# EAGLE design FA58GHZ (EAGLE 7.4.0)
Assembly variants: Standard
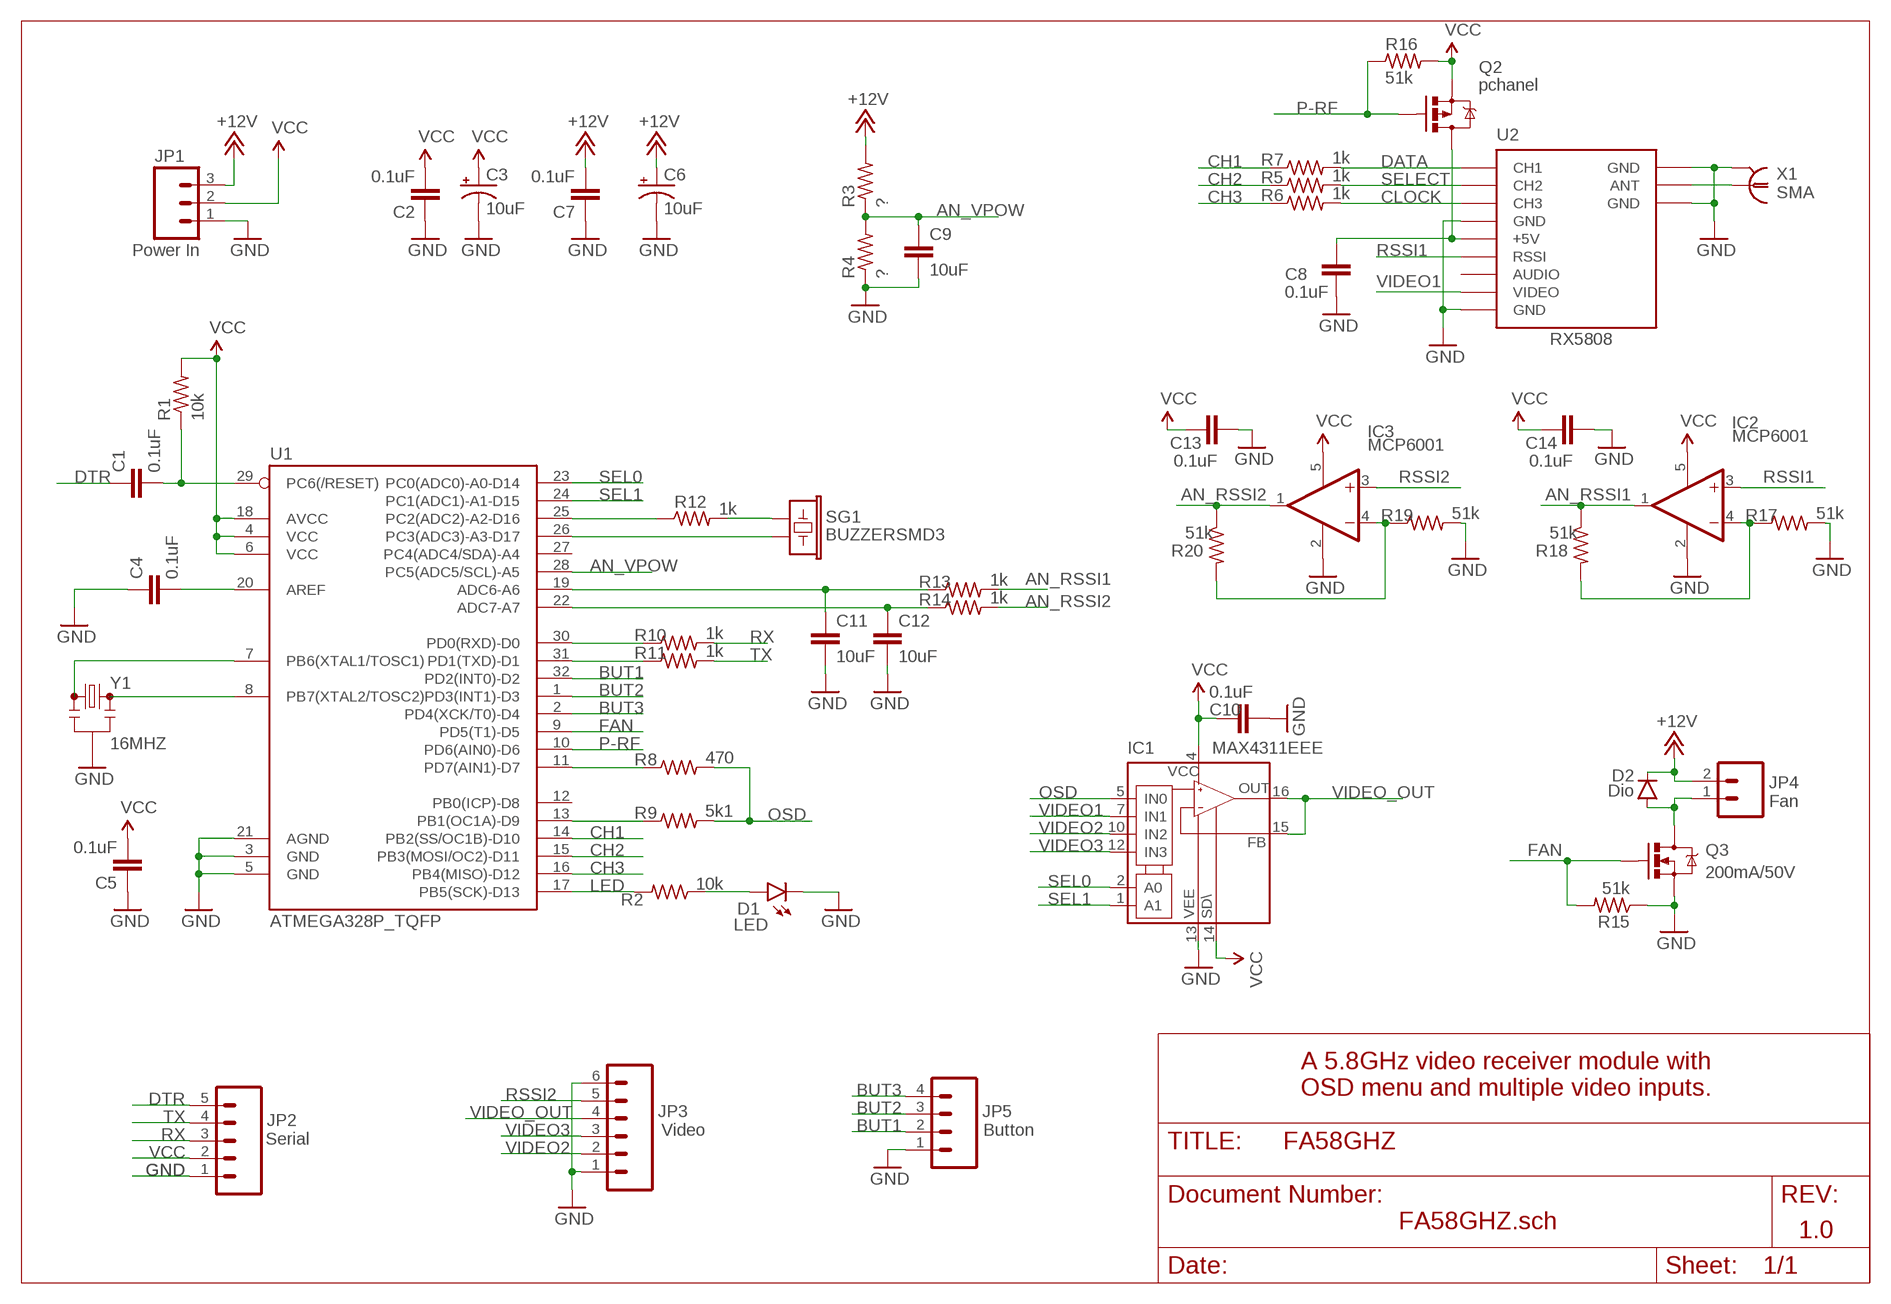
[diagram p0: schematic, sheet 1]

## Parts
C1  0.1uF  C-EUC0603  [C0603]
C2  0.1uF  C-EUC0603  [C0603]
C3  10uF  10UF-16V-10%(TANT)  [EIA3216]
C4  0.1uF  C-EUC0603  [C0603]
C5  0.1uF  C-EUC0603  [C0603]
C6  10uF  10UF-16V-10%(TANT)  [EIA3216]
C7  0.1uF  C-EUC0603  [C0603]
C8  0.1uF  C-EUC0603  [C0603]
C9  10uF  CAP0603-CAP  [0603-CAP]
C10  0.1uF  C-EUC0603  [C0603]
C11  10uF  CAP0603-CAP  [0603-CAP]
C12  10uF  CAP0603-CAP  [0603-CAP]
C13  0.1uF  C-EUC0603  [C0603]
C14  0.1uF  C-EUC0603  [C0603]
D1  LED  LED0603  [LED-0603]
D2  Dio  DIODEBAS16  [SOD-323]
IC1  MAX4311EEE  [QSOP16]
IC2  MCP6001  [SC70-5]
IC3  MCP6001  [SC70-5]
JP1  Power In  M03  [1X03-1.27MM-OFFSET]
JP2  Serial  M05  [1X05-1.27MM-OFFSET]
JP3  Video  M06  [1X06-1.27MM-OFFSET]
JP4  Fan  M02  [1X02-1.27MM-OFFSET]
JP5  Button  M04  [1X04-1.27MM-OFFSET]
Q2  pchanel  MOSFET-PCHANNEL  [SOT23-3]
Q3  200mA/50V  MOSFET-NCHANNELBSS138  [SOT23-3]
R1  10k  R-US_R0603  [R0603]
R2  10k  R-US_R0603  [R0603]
R3  ?  R-US_R0603  [R0603]
R4  ?  R-US_R0603  [R0603]
R5  1k  R-US_R0603  [R0603]
R6  1k  R-US_R0603  [R0603]
R7  1k  R-US_R0603  [R0603]
R8  470  R-US_R0603  [R0603]
R9  5k1  R-US_R0603  [R0603]
R10  1k  R-US_R0603  [R0603]
R11  1k  R-US_R0603  [R0603]
R12  1k  R-US_R0603  [R0603]
R13  1k  R-US_R0603  [R0603]
R14  1k  R-US_R0603  [R0603]
R15  51k  R-US_R0603  [R0603]
R16  51k  R-US_R0603  [R0603]
R17  51k  R-US_R0603  [R0603]
R18  51k  R-US_R0603  [R0603]
R19  51k  R-US_R0603  [R0603]
R20  51k  R-US_R0603  [R0603]
SG1  BUZZERSMD3  [BUZZER-12X12X3MM]
U1  ATMEGA328P_TQFP  [TQFP32-08]
U2  RX5808  [RX5808]
X1  SMA  SMA-SMDPCB  [SMA-PCB]
Y1  16MHZ  OSCILLATOR16MHZ  [RESONATOR-SMD]

## Nets
+12V: C6.A(+) C7.2 D2.C JP1.3 JP4.2 R3.2
AN_RSSI1: IC2.1(OUT) R13.2 R18.1
AN_RSSI2: IC3.1(OUT) R14.2 R20.1
AN_VPOW: C9.1 R3.1 R4.2 U1.28(PC5(ADC5/SCL)-A5)
BUT1: JP5.2 U1.32(PD2(INT0)-D2)
BUT2: JP5.3 U1.1(PD3(INT1)-D3)
BUT3: JP5.4 U1.2(PD4(XCK/T0)-D4)
CH1: R7.1 U1.14(PB2(SS/OC1B)-D10)
CH2: R5.1 U1.15(PB3(MOSI/OC2)-D11)
CH3: R6.1 U1.16(PB4(MISO)-D12)
CLOCK: R6.2 U2.P$7(CH3)
DATA: R7.2 U2.P$9(CH1)
DTR: C1.1 JP2.5
FAN: Q3.1(G) R15.2 U1.9(PD5(T1)-D5)
GND: C2.1 C3.C(-) C4.1 C5.1 C6.C(-) C7.1 C8.2 C9.2 C10.1 C11.2 C12.2 C13.2 C14.2 D1.C IC1.13(V-) IC2.2(V-) IC3.2(V-) JP1.1 JP2.1 JP3.1 JP3.6 JP5.1 Q3.2(S) R4.1 R15.1 R17.2 R19.2 U1.3(GND) U1.5(GND) U1.21(AGND) U2.P$1(GND) U2.P$6(GND) U2.P$10(GND) U2.P$12(GND) X1.P$1@1 X1.P$1@2 Y1.2
LED: R2.2 U1.17(PB5(SCK)-D13)
N$1: U1.8(PB7(XTAL2/TOSC2)) Y1.3
N$2: U1.7(PB6(XTAL1/TOSC1)) Y1.1
N$3: C1.2 R1.1 U1.29(PC6(/RESET))
N$4: C4.2 U1.20(AREF)
N$5: D1.A R2.1
N$6: R8.1 U1.11(PD7(AIN1)-D7)
N$7: R9.1 U1.13(PB1(OC1A)-D9)
N$8: R10.1 U1.30(PD0(RXD)-D0)
N$9: R11.1 U1.31(PD1(TXD)-D1)
N$10: R12.1 U1.25(PC2(ADC2)-A2-D16)
N$11: SG1.2 U1.26(PC3(ADC3)-A3-D17)
N$12: R12.2 SG1.1
N$13: D2.A JP4.1 Q3.3(D)
N$14: IC2.4(-IN) R17.1 R18.2
N$15: IC3.4(-IN) R19.1 R20.2
N$16: U2.P$11(ANT) X1.P$2
N$17: C12.1 R14.1 U1.22(ADC7-A7)
N$18: C11.1 R13.1 U1.19(ADC6-A6)
N$20: C8.1 Q2.3(D) U2.P$5(+5V)
OSD: IC1.5(IN0) R8.2 R9.2
P-RF: Q2.1(G) R16.1 U1.10(PD6(AIN0)-D6)
RSSI1: IC2.3(+IN) U2.P$4(RSSI)
RSSI2: IC3.3(+IN) JP3.5
RX: JP2.3 R10.2
SEL0: IC1.2(A0) U1.23(PC0(ADC0)-A0-D14)
SEL1: IC1.1(A1) U1.24(PC1(ADC1)-A1-D15)
SELECT: R5.2 U2.P$8(CH2)
TX: JP2.4 R11.2
VCC: C2.2 C3.A(+) C5.2 C10.2 C13.1 C14.1 IC1.4(V+) IC1.14(!SHDN) IC2.5(V+) IC3.5(V+) JP1.2 JP2.2 Q2.2(S) R1.2 R16.2 U1.4(VCC) U1.6(VCC) U1.18(AVCC)
VIDEO1: IC1.7(IN1) U2.P$2(VIDEO)
VIDEO2: IC1.10(IN2) JP3.2
VIDEO3: IC1.12(IN3) JP3.3
VIDEO_OUT: IC1.15(FB) IC1.16(OUT) JP3.4
Unconnected: U1.12(PB0(ICP)-D8) U1.27(PC4(ADC4/SDA)-A4) U2.P$3(AUDIO)

## Notes on the sheet
- A 5.8GHz video receiver module with
  OSD menu and multiple video inputs.
- FA58GHZ.sch
- 1.0

## Library data of the parts
C1 C2 C4 C5 C7 C8 C10 C13 C14 = resistor:C-EU: CAPACITOR, European symbol
C3 C6 = SparkFun-Capacitors:10UF-16V-10%(TANT): CAP-00811 1206/EIA-3216 Tantalum capacitor; PROD_ID: CAP-00811
C9 C11 C12 = SparkFun-Passives:CAP: Capacitor Standard 0603 ceramic capacitor, and 0.1" leaded capacitor.
D1 = SparkFun-LED:LED: LEDs Standard schematic elements and footprints for 5mm, 3mm, 1206, and 0603 sized LEDs. 5mm - Spark Fun Electronics SKU : COM-00529 (and others)
D2 = SparkFun-DiscreteSemi:DIODE: Diode These are standard reverse protection diodes and small signal diodes. SMA package can handle up to about 1A. SOD-323 can handle about 200mA. What the SOD-323 package when ordering, there are some mfgs out there that are 5-pin packages.; PROD_ID: DIO-09646; VALUE: 250mA/100V
IC1 = FreakyAttic-EagleLibrary:MAX4311: Video Multiplexer-Amplifier High-Speed, Low-Power, Single-Supply, Multichannel; MF: MAXIM; MPN: MAX4311EEE+; OC_FARNELL: unknown; OC_NEWARK: 65J5493
IC2 IC3 = FreakyAttic-EagleLibrary:MCP6001: MCP6001 • Available in SC-70-5 and SOT-23-5 packages • Gain Bandwidth Product: 1 MHz (typical) • Rail-to-Rail Input/Output • Supply Voltage: 1.8V to 6.0V • Supply Current: IQ = 100 μA (typical) • Phase Margin: 90° (typical) • Temperature Range: - Industrial: -40°C to +85°C - Extended: -40°C to +125°C • Available in Single, Dual and Quad Packages
JP1 = FreakyAttic-EagleLibrary:M03: Header 3 Standard 3-pin 0.1" header. Use with straight break away headers (SKU : PRT-00116), right angle break away headers (PRT-00553), swiss pins (PRT-00743), machine pins (PRT-00117), and female headers (PRT-00115). Molex polarized connector foot print use with SKU : PRT-08232 with associated crimp pins and housings.
JP2 = FreakyAttic-EagleLibrary:M05: Header 5 Standard 5-pin 0.1" header. Use with straight break away headers (SKU : PRT-00116), right angle break away headers (PRT-00553), swiss pins (PRT-00743), machine pins (PRT-00117), and female headers (PRT-00115). Molex polarized connector foot print use with SKU : PRT-08230 with associated crimp pins and housings.
JP3 = FreakyAttic-EagleLibrary:M06: Header 6 Standard 6-pin 0.1" header. Use with straight break away headers (SKU : PRT-00116), right angle break away headers (PRT-00553), swiss pins (PRT-00743), machine pins (PRT-00117), and female headers (PRT-00115). Molex polarized connector foot print use with SKU : PRT-08094 with associated crimp pins and housings. NOTES ON THE VARIANTS LOCK and LOCK_LONGPADS... This footprint was designed to help hold the alignment of a through-hole component (i.e. 6-pin header) while soldering it into place. You may notice that each hole has been shifted either up or down by 0.005 of an inch from it's more standard position (which is a perfectly straight line). This slight alteration caused the pins (the squares in the middle) to touch the edges of the holes. Because they are alternating, it causes a "brace" to hold the component in place. 0.005 has proven to be the perfect amount of "off-center" position when using our standard breakaway headers. Although looks a little odd when you look at the bare footprint, once you have a header in there, the alteration is very hard to notice. Also,if you push a header all the way into place, it is covered up entirely on the bottom side. This idea of altering the position of holes to aid alignment will be further integrated into the Sparkfun Library for other footprints. It can help hold any component with 3 or more connection pins.
JP4 = FreakyAttic-EagleLibrary:M02: Standard 2-pin 0.1" header. Use with - straight break away headers ( PRT-00116) - right angle break away headers (PRT-00553) - swiss pins (PRT-00743) - machine pins (PRT-00117) - female headers (PRT-00115) Molex polarized connector foot print use with: PRT-08233 with associated crimp pins and housings. 2.54_SCREWTERM for use with PRT-10571. 3.5mm Screw Terminal footprints for PRT-08084 5mm Screw Terminal footprints for use with PRT-08432
JP5 = FreakyAttic-EagleLibrary:M04: Header 4 Standard 4-pin 0.1" header. Use with straight break away headers (SKU : PRT-00116), right angle break away headers (PRT-00553), swiss pins (PRT-00743), machine pins (PRT-00117), and female headers (PRT-00115). Molex polarized connector foot print use with SKU : PRT-08231 with associated crimp pins and housings. 1MM SMD Version SKU: PRT-10208
Q2 = SparkFun-DiscreteSemi:MOSFET-PCHANNEL: Generic PMOSFET IRLML2244 - TRANS-11153 (SOT-23 -20V -4.3A) (1.Gate 2.Source 3.Drain) FQP27P06 - COM-10349 <http://www.sparkfun.com/products/10349> (TO-220 -60V -27A) (1.Gate 2.Source 3.Drain); PROD_ID: TRANS-08285
Q3 = SparkFun-DiscreteSemi:MOSFET-NCHANNEL: Common NMOSFET Parts MFG P/N Store ID Prod ID FDD8780 TRANS-09984 SI7820DN TRANS-11055 FDS6630A IC-08089 2N7002PW TRANS-11151 FQP30N06L COM-10213 TRANS-10060 BSS123LT1G TRANS-08345 BSS138 TRANS-00830 BS170 2N7000; PROD_ID: TRANS-00830
R1-R20 = resistor:R-US_: RESISTOR, American symbol
SG1 = FreakyAttic-EagleLibrary:BUZZER: Buzzer 12mm Spark Fun Electronics SKU : Comp-Buzzer
U1 = SparkFun-DigitalIC:ATMEGA328P_TQFP; PROD_ID: IC-09069
U2 = FreakyAttic-EagleLibrary:RX5808: Boscam FPV 5.8G Wireless Audio Video Receiving Module RX5808
X1 = FreakyAttic-EagleLibrary:SMA-SMD: SMA for border PCB
Y1 = FreakyAttic-EagleLibrary:OSCILLATOR: Resonator Small SMD resonator. Used, eg, on the Arduino Pro/ Pro Mini boards. 8MHz- XTAL-08895 16MHz- XTAL-08900; PROD_ID: XTAL-08900

## Net classes
0 default: clearance 0.205 mm

## Board
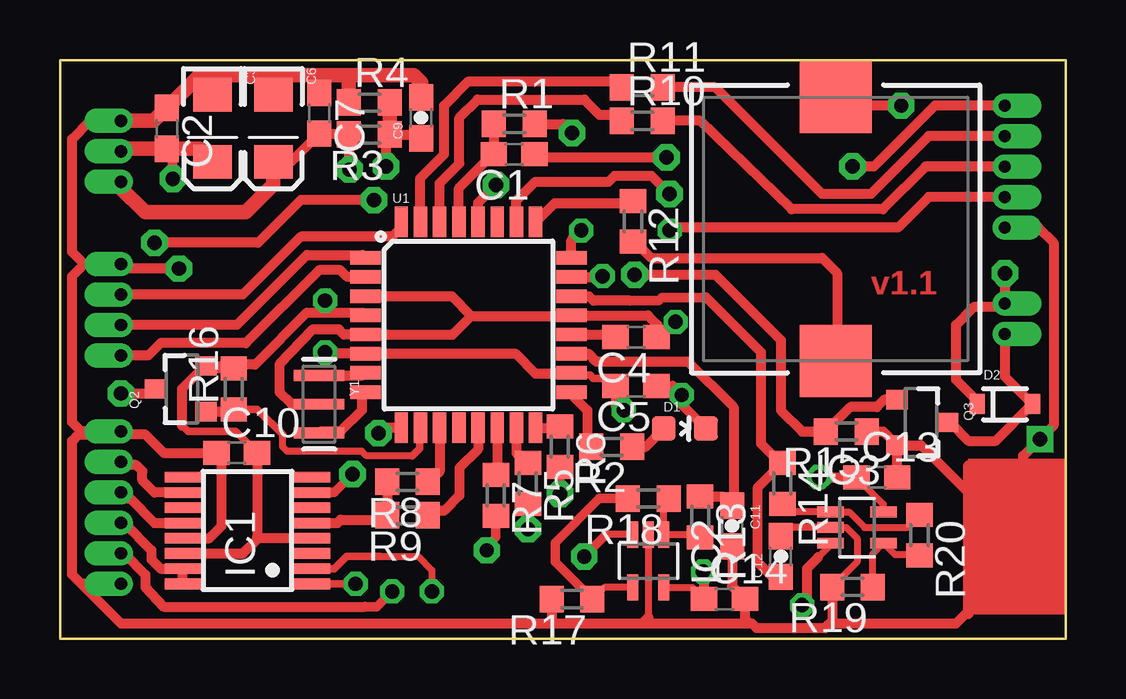
[diagram p1: board, top side]
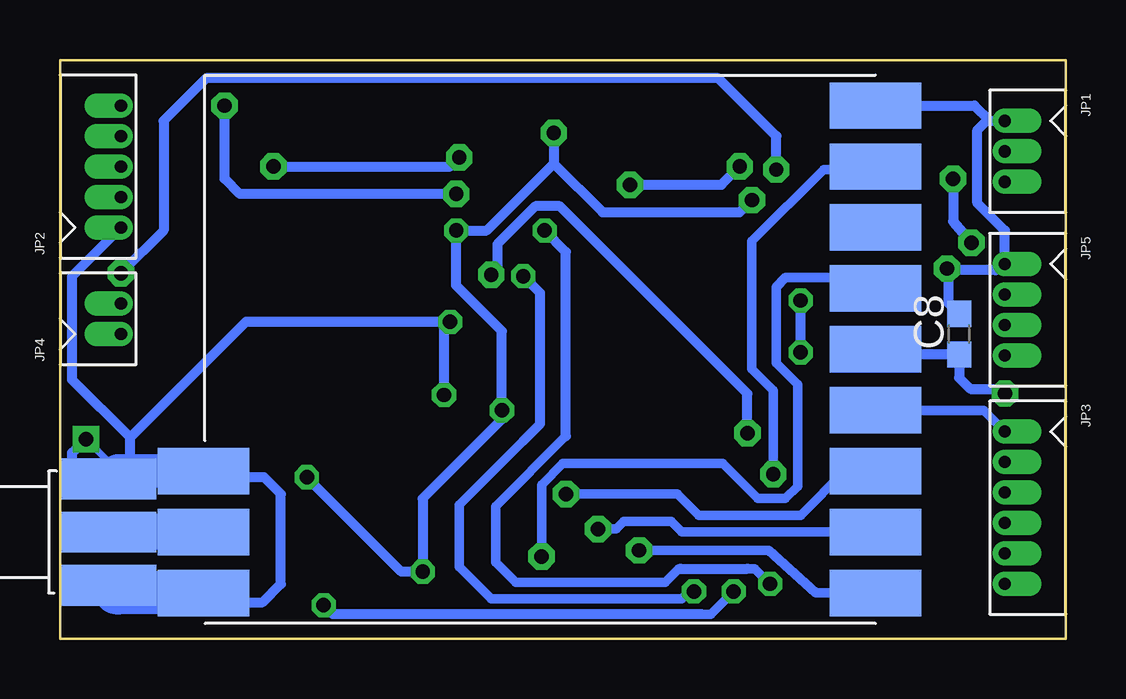
[diagram p2: board, bottom side, seen from below]

Size 41.91 x 24.13 mm. Coordinates in mm from the lower left corner, seen from the top.
Outline: 0,0 41.91,0 41.91,24.13 0,24.13 0,0
Copper layers (1*16): Top 0.035mm / dielectric 1.5mm / Bottom 0.035mm
Design rules "default": minimum track width 10mil, minimum drill 24mil, track to track 8mil, track to pad 8mil, pad to pad 8mil, via to via 8mil, smd to smd 8mil, copper to edge 40mil, drill to drill 8mil, minimum pad ring 10mil, minimum via ring 8mil, stop-mask expansion 4mil, vias tented up to drill 0mil, thermal gap 10mil

### Footprints (pad centres in the part's own frame; a part is rotated, then mirrored left to right if it is on the bottom)
C0603 = smd 1.1 x 1: 1 -0.85,0; 2 0.85,0
EIA3216 = smd 1.4 x 1.6: A 1.4,0; C -1.4,0
0603-CAP = smd 1.1 x 1: 1 -0.85,0; 2 0.85,0
LED-0603 = smd 1 x 1: A 0,-0.877; C 0,0.877
SOD-323 = smd 0.63 x 0.83: A 1.15,0; C -1.15,0
QSOP16 = smd 0.44 x 1.5: 1 -2.223,-2.69; 2 -1.587,-2.69; 3 -0.953,-2.69; 4 -0.318,-2.69; 5 0.318,-2.69; 6 0.953,-2.69; 7 1.587,-2.69; 8 2.223,-2.69; 9 2.223,2.69; 10 1.587,2.69; 11 0.953,2.69; 12 0.318,2.69; 13 -0.318,2.69; 14 -0.953,2.69; 15 -1.587,2.69; 16 -2.223,2.69
SC70-5 = smd 0.45 x 1.1: 1 -0.65,-1.1; 2 0,-1.1; 3 0.65,-1.1; 4 0.65,1.1; 5 -0.65,1.1
1X03-1.27MM-OFFSET = drill 0.508 pad 1 offset: 1 0,0; 2 1.27,0; 3 2.54,0
1X05-1.27MM-OFFSET = drill 0.508 pad 1 offset: 1 0,0; 2 1.27,0; 3 2.54,0; 4 3.81,0; 5 5.08,0
1X06-1.27MM-OFFSET = drill 0.508 pad 1 offset: 1 0,0; 2 1.27,0; 3 2.54,0; 4 3.81,0; 5 5.08,0; 6 6.35,0
1X02-1.27MM-OFFSET = drill 0.508 pad 1 offset: 1 0,0; 2 1.27,0
1X04-1.27MM-OFFSET = drill 0.508 pad 1 offset: 1 0,0; 2 1.27,0; 3 2.54,0; 4 3.81,0
SOT23-3 = smd 0.8 x 0.9: 1 -0.95,-1; 2 0.95,-1; 3 0,1.1
R0603 = smd 1 x 1.1: 1 -0.85,0; 2 0.85,0
BUZZER-12X12X3MM = smd 3 x 3: 1 -5.5,0; 2 5.5,0
TQFP32-08 = smd 1.27 x 0.559: 1 -4.293,2.8; 2 -4.293,2; 3 -4.293,1.2; 4 -4.293,0.4; 5 -4.293,-0.4; 6 -4.293,-1.2; 7 -4.293,-2; 8 -4.293,-2.8; 17 4.293,-2.8; 18 4.293,-2; 19 4.293,-1.2; 20 4.293,-0.4; 21 4.293,0.4; 22 4.293,1.2; 23 4.293,2; 24 4.293,2.8 | smd 0.559 x 1.27: 9 -2.8,-4.293; 10 -2,-4.293; 11 -1.2,-4.293; 12 -0.4,-4.293; 13 0.4,-4.293; 14 1.2,-4.293; 15 2,-4.293; 16 2.8,-4.293; 25 2.8,4.293; 26 2,4.293; 27 1.2,4.293; 28 0.4,4.293; 29 -0.4,4.293; 30 -1.2,4.293; 31 -2,4.293; 32 -2.8,4.293
RX5808 = smd 3.81 x 1.93: P$1 0,-20.32; P$2 0,-17.78; P$3 0,-15.24; P$4 0,-12.7; P$5 0,-10.16; P$6 0,-7.62; P$7 0,-5.08; P$8 0,-2.54; P$9 0,0; P$10 28,0; P$11 28,-2.54; P$12 28,-5.08
SMA-PCB = smd 4 x 1.7: P$1@1 2,-0.318; P$1@2 2,-4.763; P$2 2,-2.54
RESONATOR-SMD = smd 0.45 x 2.1: 1 -1.2,0; 2 0,0; 3 1.2,0

### Placement (x,y rotation side)
C1  18.92,20.19 180 top
C2  4.45,21.27 270 top
C3  6.35,21.27 270 top
C4  24,12.57 180 top
C5  24,10.54 180 top
C6  8.89,21.27 270 top
C7  10.79,21.91 270 top
C8  4.45,12.7 90 bottom
C9  15.05,21.72 90 top
C10  7.37,7.75 0 top
C11  28,4.7 270 top
C12  30.04,3.43 90 top
C13  34.04,6.73 0 top
C14  27.69,1.65 0 top
D1  26.04,8.76 270 top
D2  39.37,9.78 0 top
IC1  7.81,4.51 90 top
IC2  24.51,3.24 180 top
IC3  33.21,4.64 270 top
JP1  2.54,21.59 270 bottom
JP2  39.37,17.14 90 bottom
JP3  2.54,8.64 270 bottom
JP4  39.37,12.7 90 bottom
JP5  2.54,15.62 270 bottom
Q2  5.08,10.41 90 top
Q3  35.88,9.02 270 top
R1  18.92,21.46 0 top
R2  22.99,8 180 top
R3  12.89,21.02 180 top
R4  12.89,22.35 0 top
R5  19.49,6.48 270 top
R6  20.83,8 270 top
R7  18.16,5.97 270 top
R8  14.48,6.54 180 top
R9  14.48,5.14 180 top
R10  24.26,21.59 0 top
R11  24.26,22.99 0 top
R12  23.88,17.4 270 top
R13  26.67,5.08 270 top
R14  30.1,6.48 270 top
R15  32.77,8.64 180 top
R16  7.24,10.41 90 top
R17  21.34,1.65 180 top
R18  24.51,5.84 180 top
R19  33.02,2.16 180 top
R20  35.81,4.32 270 top
SG1  32.32,17.08 90 top
U1  17.02,13.08 0 top
U2  7.94,1.91 180 bottom
X1  41.91,6.99 0 bottom
Y1  10.79,9.78 270 top

### Tracks (layer width: path | path; a pad name or v marks a point on that pad's centre or on a via)
+12V  (via drill 0.6 pad 1.1)
  Top 0.406: C6.A 9.61,19.87 C7.2 12,21.06 R3.2 12.04,19.58 v12.06,19.56 | v39.37,15.24 JP4.2 39.24,13.84 38.1,13.84 37.34,13.08 37.34,10.79 38.22,9.91 D2.C
  Top 0.61: JP1.3 2.54,18.8 3.56,17.78 7.75,17.78 8.89,18.92 C6.A
  Bottom 0.406: v12.06,19.56 12.06,20.95 14.48,23.37 35.81,23.37 37.59,21.59 37.59,17.02 v39.37,15.24
AN_RSSI1
  Top 0.3: R13.2 26.56,4.34 IC2.1 25.16,5.64 R18.1
  Top 0.406: 26.55,4.35 R13.2
AN_RSSI2
  Top 0.3: R20.1 35.28,4.64 33.53,4.64 32.88,5.29 IC3.1 30.44,5.29 R14.2
  Top 0.406: 30.33,5.39 R14.2
AN_VPOW  (via drill 0.6 pad 1.1)
  Top 0.406: C9.1 14.9,21.02 R3.1 13.59,20.87 v13.59,19.68 | U1.28 17.42,18.18 v18.16,18.92
  Top 0.61: R4.2 R3.1
  Bottom 0.406: v18.16,18.92 14.35,18.92 v13.59,19.68
BUT1
  Top 0.406: U1.32 14.22,17.14 13.84,16.76 10.03,16.76 7.62,14.35 JP5.2
BUT2
  Top 0.406: JP5.3 7.37,13.08 10.29,16 12.6,16 U1.1
BUT3
  Top 0.406: JP5.4 3.68,11.81 4.19,12.32 7.75,12.32 10.79,15.37 11.68,15.37 11.97,15.08 U1.2
CH1
  Top 0.406: U1.14 18.22,6.88 R7.1
CH2
  Top 0.406: U1.15 19.02,7.74 R5.1
CH3
  Top 0.406: U1.16 20.77,8.79 R6.1
CLOCK  (via drill 0.6 pad 1.1)
  Top 0.4: R6.2 v20.83,6.03
  Bottom 0.4: U2.P$7 9.21,6.99 11.05,5.14 15.3,5.14 16.19,6.03 v20.83,6.03
DATA  (via drill 0.6 pad 1.1)
  Top 0.4: R7.2 18.16,4.25 v17.78,3.68
  Bottom 0.4: 8,1.84 U2.P$9 10.41,1.91 12.38,3.68 v17.78,3.68
DTR  (via drill 0.6 pad 1.1)
  Top 0.406: v25.27,20.07 19.9,20.07 C1.1 | JP2.5 36.45,22.23 33.91,19.68 v33.02,19.68
  Bottom 0.406: v33.02,19.68 25.65,19.68 v25.27,20.07
FAN  (via drill 0.6 pad 1.1)
  Top 0.406: Q3.1 34.35,9.97 34.04,9.65 32.93,9.65 R15.2 30.92,8.64 30.04,9.53 30.04,12.45 27.3,15.18 v23.94,15.18 | U1.9 13.49,8.79 v13.27,8.57
  Bottom 0.406: v13.27,8.57 13.27,10.22 21.08,18.03 22.1,18.03 23.69,16.45 23.69,15.43 v23.94,15.18
GND  (via drill 0.6, 0.6 pad 1.1)
  Top 0.3: IC2.2 24.51,0.89 | C12.2 30.39,4.64 IC3.2 32.77,4.64 33.21,4.19 33.21,3.2 R19.2
  Top 0.406: JP3.6 0.89,2.29 | 0.89,2.29 0.51,2.67 0.51,8.26 0.76,8.51 2.41,8.51 JP3.1 | JP3.1 0.89,8.64 0.51,9.02 0.51,15.11 1.02,15.62 | 1.02,15.62 JP5.1 2.73,15.43 v4.95,15.43 | 1.02,15.62 0.51,16.13 0.51,20.83 1.27,21.59 JP1.1 | 0.89,2.29 2.54,0.64 20.45,0.64 | 20.45,0.64 24.26,0.64 | 24.26,0.64 28.77,0.64 | 37.85,1.14 37.34,0.64 32.32,0.64 32.17,0.72 | 37.85,1.14 37.85,5.71 | 37.85,5.71 37.85,6.1 | 37.85,6.1 37.85,7.24 | JP2.1 40.77,17.14 41.4,16.51 41.4,8.89 v40.83,8.32 40.13,7.62 40.13,7.11 39.24,7.11 37.85,5.71 | IC1.13 6.22,4.19 6.73,4.7 6.73,7.45 C10.1 4.32,7.75 3.56,8.51 2.67,8.51 JP3.1 | 17.14,13.46 16.33,14.28 U1.3 | 17.14,13.46 21.29,13.46 U1.21 24.49,13.48 24.89,13.08 24.89,12.61 C4.1 25.02,12.57 v25.65,13.21 | R15.1 34.31,8.64 Q3.2 | 32.17,2.33 R19.2 32.17,0.72 | Q3.2 35.88,8.07 37.85,6.1 | C13.2 34.89,8.06 Q3.2 | 28.77,0.64 28.54,0.8 C14.2 28,2.18 C11.2 | 24.51,0.89 24.26,0.64 | R17.2 20.49,0.67 20.45,0.64 | 37.85,1.14 37.85,1.02 | D1.C 25.13,10.54 C5.1 25.53,10.54 v25.91,10.16 | 17.14,13.46 16.36,12.68 U1.5 11.83,12.68 11.62,12.89 10.54,12.89 9.14,11.43 9.14,10.29 9.65,9.78 Y1.2 | 28.77,0.64 28.83,0.64 29.02,0.45 31.89,0.45 32.17,0.72
  Top 0.61: JP1.1 3.91,21.59 C2.1 5.82,23.5 6.35,23.5 | C9.2 15.05,23.18 14.73,23.5 11.94,23.5 | 11.94,23.5 10.79,23.5 | 10.79,23.5 8.76,23.5 | 8.76,23.5 6.35,23.5 | C7.1 10.79,23.5 | R4.1 12.04,23.39 11.94,23.5 | C3.C 6.35,23.5 | C6.C 8.89,23.37 8.76,23.5
  Bottom 0.3: 39.5,6.99 v40.83,8.32 | X1.P$1@2 40.01,2.22 40.07,2.29 39.12,2.29 38.51,1.68
  Bottom 0.4: U2.P$6 3.43,9.53 JP3.1
  Bottom 0.406: 3.17,21.59 3.3,21.59 3.68,21.21 3.68,18.16 2.54,17.02 JP5.1 2.67,15.62 2.92,15.37 4.89,15.37 4.89,13.99 C8.2 | 3.17,21.59 JP1.1 | 38.99,8.38 41.4,10.79 41.4,15.11 JP2.1 | 38.73,1.91 38.51,1.68 38.35,1.52 33.47,1.52 32.7,2.29 32.7,6.03 33.4,6.73 39.24,6.73 | 38.99,8.38 34.16,13.21 v25.65,13.21 25.91,12.95 v25.91,10.16 | X1.P$1@1 39.85,6.73 39.24,6.73 | 39.24,6.73 38.99,6.99 38.99,8.38 | 40.89,6.79 41.4,7.3 41.4,7.75 v40.83,8.32 | U2.P$1 3.81,22.23 3.17,21.59
  Bottom 1.4: U2.P$12 39.5,6.99
  Bottom 1.778: 38.73,1.91 39.5,1.91 39.59,1.91
  Bottom 1.8: U2.P$10 39.5,1.91
LED
  Top 0.406: U1.17 21.31,10.19 21.97,9.53 21.97,8.17 R2.2
N$1
  Top 0.406: U1.8 12.57,10.13 12.57,9.53 11.68,8.64 10.85,8.64 Y1.3
N$2
  Top 0.406: 12.7,11.11 U1.7 12.62,10.98 Y1.1
N$3
  Top 0.406: U1.29 16.62,18.78 18.03,20.19 | 18.03,20.19 18.07,20.23 R1.1 | C1.2 18.03,20.19
N$4
  Top 0.406: U1.20 22.63,12.68 C4.2
N$5
  Top 0.406: R2.1 24.4,8 D1.A
N$6
  Top 0.406: U1.11 15.82,6.97 R8.1
N$7
  Top 0.406: U1.13 17.42,7.89 16.64,7.11 16.64,5.97 16,5.33 15.46,5.33 R9.1
N$8
  Top 0.406: U1.30 15.82,18.99 16.64,19.81 16.64,21.72 17.4,22.48 21.84,22.48 22.48,21.84 23.28,21.84 R10.1
N$9
  Top 0.406: U1.31 15.02,19.21 16,20.19 16,22.23 17.02,23.24 23.15,23.24 R11.1
N$10
  Top 0.406: R12.1 23.79,18.16 20.61,18.16 U1.25
N$11  (via drill 0.6 pad 1.1)
  Top 0.406: U1.26 19.02,18.26 19.81,19.05 22.86,19.05 23.11,19.3 24.64,19.3 v25.4,18.54 | v35.05,22.23 32.68,22.23 SG1.2
  Bottom 0.406: v25.4,18.54 34.42,18.54 35.05,19.18 v35.05,22.23
N$12
  Top 0.406: R12.2 23.96,16.55 24.64,15.88 31.75,15.88 32.38,15.24 32.38,11.64 SG1.1
N$13
  Top 0.406: JP4.1 39.37,10.93 D2.A 39,8.26 37.85,8.26 37.08,9.02 Q3.3
N$14
  Top 0.3: IC2.4 22.67,2.14 R17.1
  Top 0.4: R18.2 22.48,5.84 20.64,4 20.64,3.2 R17.1
  Top 0.406: 22.28,1.74 R17.1
N$15
  Top 0.3: R19.1 33.87,3.54 IC3.4 34.8,3.5 35.79,3.5
  Top 0.406: 35.79,3.5 R20.2
N$16
  Bottom 1.5: U2.P$11 X1.P$2
N$17
  Top 0.4: 23.75,14.1 24.96,14.1 25.08,14.22 26.92,14.22
  Top 0.406: U1.22 22.04,14.28 22.23,14.1 23.75,14.1 | C12.1 29.68,2.58 29.08,3.17 29.08,6.31 R14.1 30.01,7.33 29.21,8.13 29.21,11.94 26.92,14.22
N$18
  Top 0.406: U1.19 22.03,11.88 22.35,11.56 26.16,11.56 28.07,9.65 28.07,5.61 C11.1 27.62,5.93 R13.1
N$20  (via drill 0.6 pad 1.1)
  Top 0.406: v2.54,10.22 3.79,10.22 Q2.3
  Bottom 0.406: U2.P$5 7.72,11.85 C8.1 4.45,10.88 Q2.3 2.73,10.41 v2.54,10.22
OSD
  Top 0.406: IC1.5 11.56,4.83 11.68,4.95 13.37,4.95 R9.2 R8.2
P-RF
  Top 0.3: 14.67,7.62 12.76,7.62 12.57,7.81 9.46,7.81 9.27,8 9.27,8.51
  Top 0.305: R16.1 8.22,9.56 9.27,8.51 | 14.67,7.62 14.99,7.94 14.99,8.76
  Top 0.406: Q2.1 7.14,9.46 R16.1 | 14.99,8.76 U1.10
RSSI1  (via drill 0.6 pad 1.1)
  Top 0.3: IC2.3 22.79,4.34 22.77,4.35
  Top 0.4: 22.77,4.35 v21.84,3.43
  Bottom 0.4: v21.84,3.43 21.84,6.41 20.95,7.3 14.29,7.3 12.83,5.84 11.68,5.84 11.18,6.35 11.18,10.6 12.06,11.49 12.06,14.67 11.68,15.05 8.38,15.05 U2.P$4
RSSI2  (via drill 0.6)
  Top 0.3: IC3.3 32.11,3.92 31.59,3.39
  Top 0.4: 12.7,1.33 13.21,1.33 v13.84,1.97
  Top 0.406: JP3.5 2.67,3.56 3.56,2.67 3.56,2.16 4.32,1.33 12.7,1.33 | 31.59,3.39 31.11,2.92 31.11,1.65 v30.92,1.4
  Bottom 0.4: 15.18,1.02 14.8,1.02 v13.84,1.97
  Bottom 0.406: 15.18,1.02 30.54,1.02 v30.92,1.4
RX
  Top 0.406: JP2.3 36.07,19.68 34.29,17.91 30.48,17.91 26.67,21.59 R10.2
SEL0  (via drill 0.6)
  Top 0.3: 13.34,3.43 14.92,3.43 15.49,2.86 v15.49,1.97
  Top 0.305: 13.34,3.43 11.94,3.43 11.43,2.92 IC1.2
  Top 0.406: U1.23 22.57,15.08 v22.61,15.11
  Bottom 0.4: v15.49,1.97 15.68,1.97 16,1.65 23.94,1.65 25.27,2.98 25.27,5.59 22.61,8.26
  Bottom 0.406: 22.61,8.26 21.91,8.95 21.91,14.41 v22.61,15.11
SEL1  (via drill 0.6)
  Top 0.305: IC1.1 v12.32,2.29
  Top 0.4: 12,2.22 12.26,2.22 v12.32,2.29
  Top 0.406: U1.24 21.31,16.61 v21.72,17.02
  Bottom 0.4: 13.27,2.92 12.95,2.92 v12.32,2.29 | 16.07,2.92 16.13,2.92 16.7,2.35 22.92,2.35 23.75,3.17 23.75,5.52 20.83,8.45
  Bottom 0.406: 16.07,2.92 13.27,2.92 | 20.83,8.45 20.83,16.13 v21.72,17.02
SELECT  (via drill 0.6 pad 1.1)
  Top 0.4: R5.2 v19.49,4.57
  Bottom 0.4: v19.49,4.57 18.73,4.57 18.41,4.89 16.45,4.89 16,4.45 U2.P$8
TX
  Top 0.406: JP2.4 36.2,20.95 33.78,18.54 31.75,18.54 27.3,22.99 R11.2
VCC  (via drill 0.6, 0.6 pad 1.1)
  Top 0.3: IC2.5 26.35,2.14 C14.1 | IC3.5 34.31,5.61 C13.1
  Top 0.305: 5.08,8.89 5.33,8.64 7.33,8.64 C10.2 | C5.2 23.05,10.54 22.73,10.86 22.23,10.86 22.1,10.99 21.41,10.99 U1.18
  Top 0.406: Q2.2 7.14,11.36 R16.2 | IC1.14 7.62,3.56 8.26,4.19 | R1.2 20.95,21.46 v21.34,21.08 | v13.08,18.29 10.03,18.29 8.26,16.51 v3.94,16.51 | v4.7,19.18 4.7,20.04 C2.2 | R16.2 7.41,11.43 8.13,11.43 10.29,13.59 11.05,13.59 | R16.2 5.93,11.26 5.08,10.41 5.08,8.89 | JP2.2 36.2,18.41 34.92,17.14 25.53,17.14 v25.4,17.02 | C5.2 23.15,9.74 v23.5,9.53 | 26.75,1.74 C14.1 26.84,2.75 v26.8,2.79 | v31.62,6.73 C13.1 | 11.05,13.59 12.62,13.59 U1.4 | v11.05,14.1 11.05,13.59 | U1.18 21.28,11.05 19.81,11.05 18.98,11.88 U1.6 11.11,11.88 v11.05,11.94 | IC1.4 8.26,4.19 | C10.2 8.22,4.23 8.26,4.19
  Top 0.61: JP1.2 2.64,20.42 C2.2 5.8,20.42 C3.A
  Bottom 0.406: v21.34,21.08 21.34,19.81 | 21.34,19.81 19.3,17.78 13.59,17.78 v13.08,18.29 | 21.34,19.81 24.13,17.02 v25.4,17.02 25.4,14.73 23.5,12.83 v23.5,9.53 23.5,9.14 26.8,5.84 v26.8,2.79 27.69,2.79 v31.62,6.73 | v4.7,19.18 4.7,17.4 v3.94,16.51 | v11.05,11.94 v11.05,14.1
VIDEO1  (via drill 0.6 pad 1.1)
  Top 0.4: IC1.7 11.43,6.1 v12.19,6.86
  Bottom 0.4: U2.P$2 8.06,19.56 10.1,19.56 13.08,16.57 13.08,11.24 12.19,10.35 v12.19,6.86
VIDEO2
  Top 0.406: IC1.10 3.94,6.1 3.43,6.6 3.43,6.99 3.17,7.24 2.67,7.24 JP3.2
VIDEO3
  Top 0.406: JP3.3 2.79,5.84 2.92,5.84 3.94,4.83 IC1.12
VIDEO_OUT
  Top 0.406: IC1.16 IC1.15 4.19,2.92 3.81,3.3 3.81,3.68 2.67,4.83 JP3.4
(copper drawn outside any net)
  shapes: Top area x1

### Text on the board
Top: v1.1